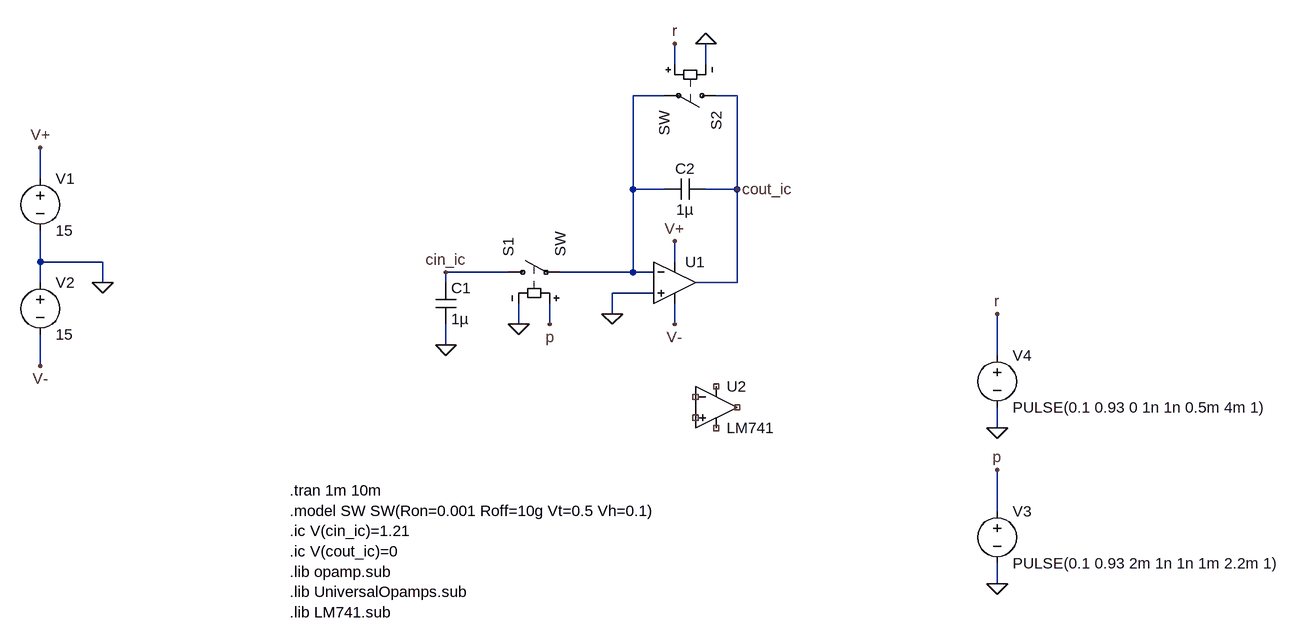
[diagram p0: schematic Draft3.asc]
Draft3.asc, the LTspice schematic file:
Version 4
SHEET 1 1980 768
WIRE 1040 -48 1040 -80
WIRE 1088 -48 1088 -80
WIRE 1024 0 976 0
WIRE 1136 0 1104 0
WIRE 64 128 64 80
WIRE 976 144 976 0
WIRE 1024 144 976 144
WIRE 1136 144 1136 0
WIRE 1136 144 1088 144
WIRE 64 256 64 208
WIRE 160 256 64 256
WIRE 1040 256 1040 224
WIRE 784 272 688 272
WIRE 976 272 976 144
WIRE 976 272 864 272
WIRE 1008 272 976 272
WIRE 64 288 64 256
WIRE 160 288 160 256
WIRE 688 288 688 272
WIRE 1136 288 1136 144
WIRE 1136 288 1072 288
WIRE 1008 304 944 304
WIRE 944 336 944 304
WIRE 800 352 800 320
WIRE 848 352 848 320
WIRE 1040 352 1040 320
WIRE 688 384 688 352
WIRE 1536 400 1536 336
WIRE 64 416 64 368
WIRE 1536 512 1536 480
WIRE 1536 640 1536 576
WIRE 1536 752 1536 720
FLAG 64 80 V+
FLAG 64 416 V-
FLAG 160 288 0
FLAG 1040 224 V+
FLAG 1040 352 V-
FLAG 944 336 0
FLAG 1536 752 0
FLAG 688 384 0
FLAG 800 352 0
FLAG 688 272 cin_ic
FLAG 1136 144 cout_ic
FLAG 1536 576 p
FLAG 848 352 p
FLAG 1088 -80 0
FLAG 1040 -80 r
FLAG 1536 512 0
FLAG 1536 336 r
SYMBOL Opamps/UniversalOpamp2 1040 288 R0
SYMATTR InstName U1
SYMBOL voltage 64 112 R0
SYMATTR InstName V1
SYMATTR Value 15
SYMBOL voltage 64 272 R0
SYMATTR InstName V2
SYMATTR Value 15
SYMBOL voltage 1536 624 R0
SYMATTR InstName V3
SYMATTR Value PULSE(0.1 0.93 2m 1n 1n 1m 2.2m 1)
SYMBOL cap 672 288 R0
SYMATTR InstName C1
SYMATTR Value 1µ
SYMBOL cap 1088 128 R90
WINDOW 0 0 32 VBottom 2
WINDOW 3 32 32 VTop 2
SYMATTR InstName C2
SYMATTR Value 1µ
SYMBOL sw 768 272 R270
SYMATTR InstName S1
SYMBOL sw 1120 0 R90
SYMATTR InstName S2
SYMBOL voltage 1536 384 R0
SYMATTR InstName V4
SYMATTR Value PULSE(0.1 0.93 0 1n 1n 0.5m 4m 1)
SYMBOL Opamps/opamp2 1104 416 R0
SYMATTR InstName U2
SYMATTR Value LM741
TEXT 448 608 Left 2 !.tran 1m 10m\n.model SW SW(Ron=0.001 Roff=10g Vt=0.5 Vh=0.1)\n.ic V(cin_ic)=1.21\n.ic V(cout_ic)=0\n.lib opamp.sub\n.lib UniversalOpamps.sub\n.lib LM741.sub

The netlist it stands for:
* Draft3.asc
XU1 0 N001 V+ V- cout_ic level.2 Avol=1Meg GBW=10Meg Slew=10Meg ilimit=25m rail=0 Vos=0 phimargin=45 en=0 enk=0 in=0 ink=0 Rin=500Meg  ; pins IN+ IN- V+ V- OUT
V1 V+ 0 15
V2 0 V- 15
V3 p 0 PULSE(0.1 0.93 2m 1n 1n 1m 2.2m 1)
C1 cin_ic 0 1µ
C2 cout_ic N001 1µ
S1 cin_ic N001 p 0 SW
S2 cout_ic N001 r 0 SW
V4 r 0 PULSE(0.1 0.93 0 1n 1n 0.5m 4m 1)
XU2 NC_01 NC_02 NC_03 NC_04 NC_05 LM741  ; pins In+ In- V+ V- OUT
.tran 1m 10m
.model SW SW(Ron=0.001 Roff=10g Vt=0.5 Vh=0.1)
.ic V(cin_ic)=1.21
.ic V(cout_ic)=0
.lib opamp.sub
.lib UniversalOpamps.sub
.lib LM741.sub
.lib UniversalOpamps2.sub
.backanno
.end